# EAGLE design KatanaLRS-Rev1g (EAGLE 6.1)
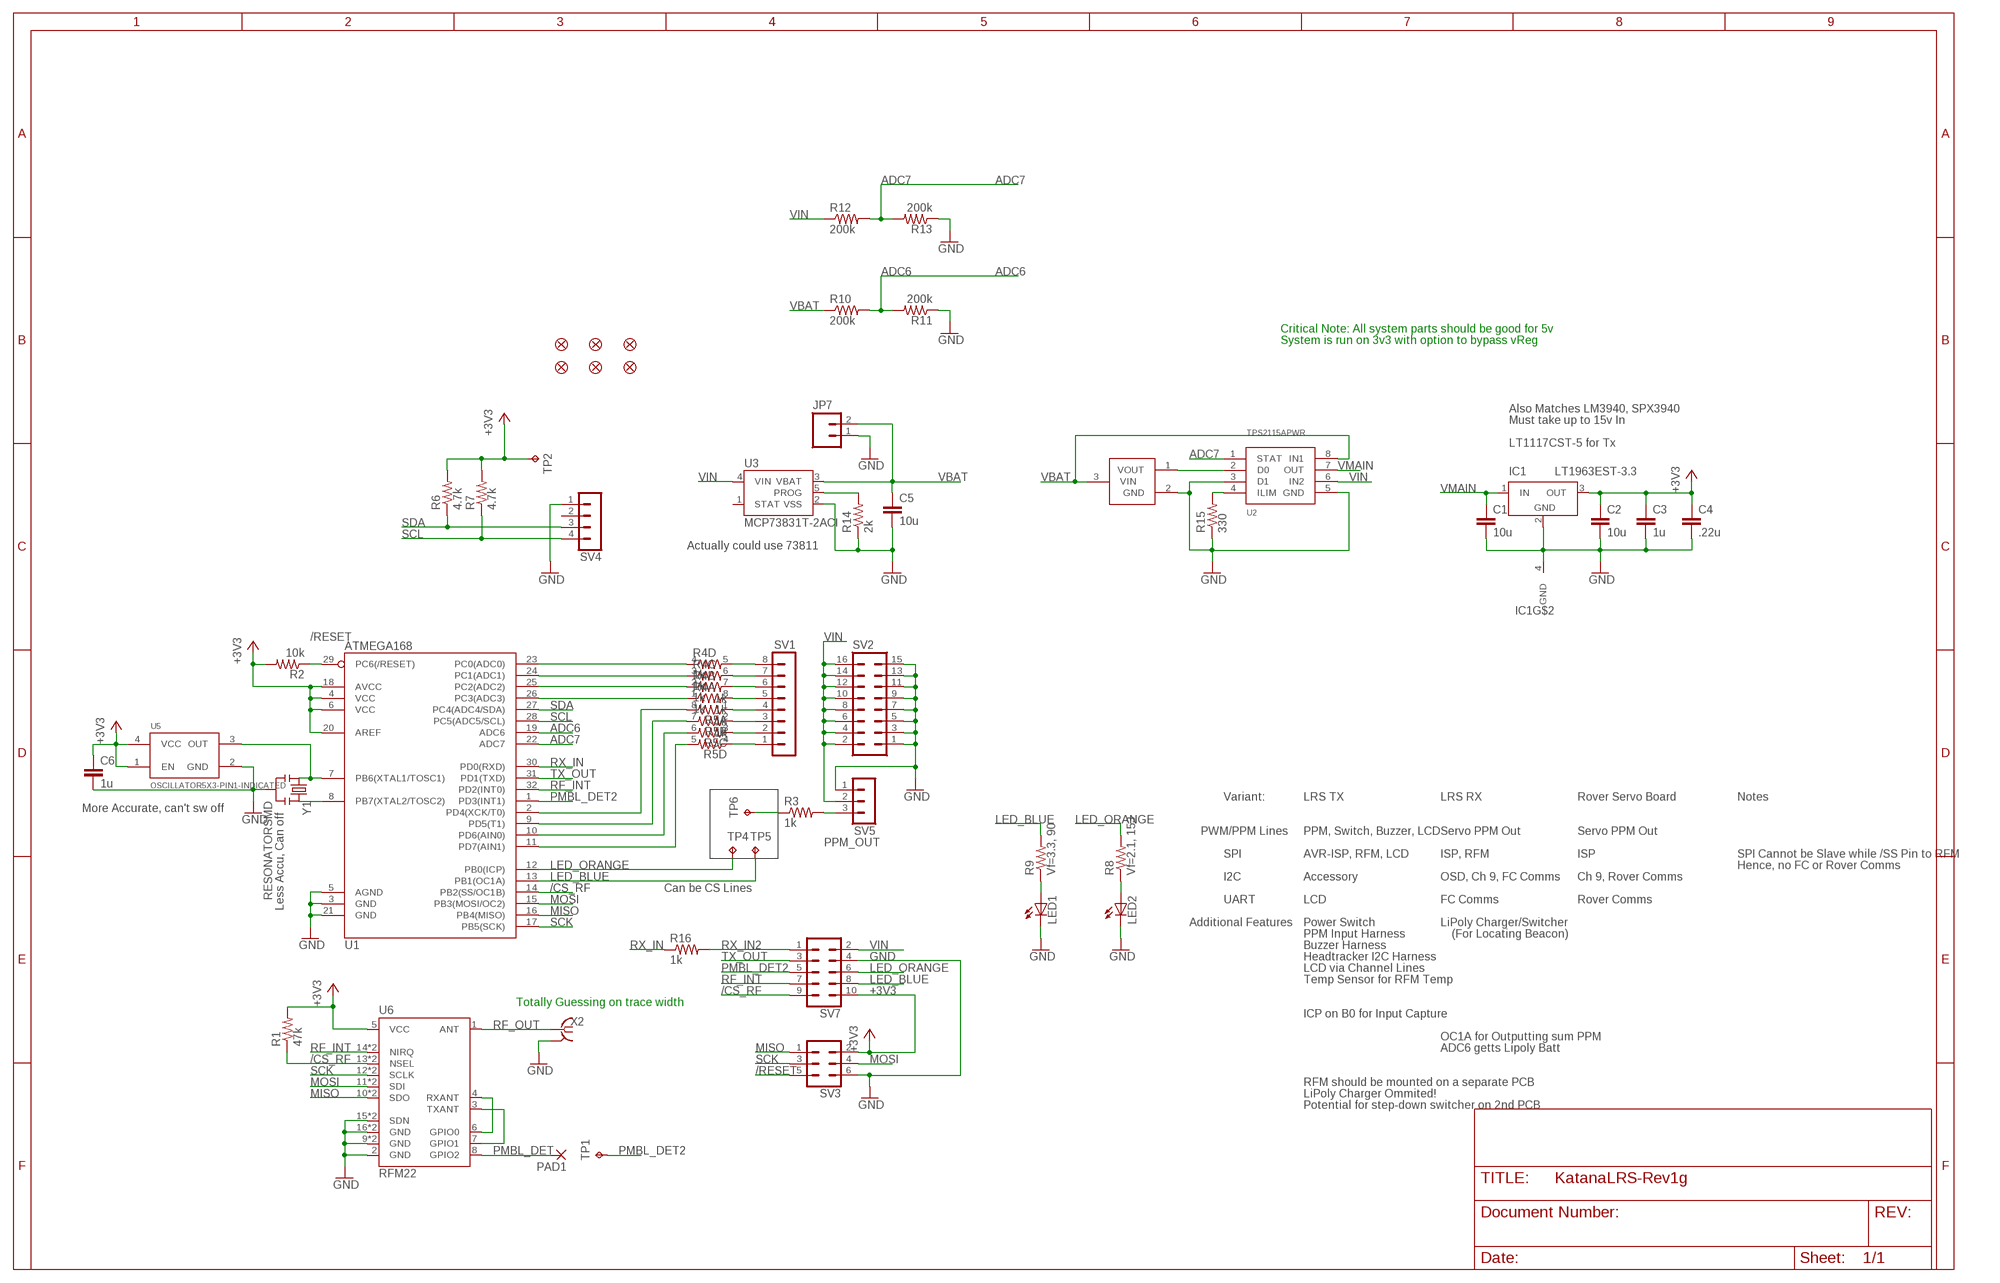
[diagram p0: schematic, sheet 1]

## Parts
C1  10u  CAP1206  [1206]
C2  10u  CAP1206  [1206]
C3  1u  CAP0603-CAP  [0603-CAP]
C4  .22u  CAP0603-CAP  [0603-CAP]
C5  10u  CAP1206  [1206]
C6  1u  CAP0805  [0805]
IC1  LT1963EST-3.3  [SOT223]
JP1  FIDUCIALUFIDUCIAL  [MICRO-FIDUCIAL]
JP2  FIDUCIALUFIDUCIAL  [MICRO-FIDUCIAL]
JP3  FIDUCIALUFIDUCIAL  [MICRO-FIDUCIAL]
JP4  FIDUCIALUFIDUCIAL  [MICRO-FIDUCIAL]
JP6  FIDUCIALUFIDUCIAL  [MICRO-FIDUCIAL]
JP7  M02JST-PTH-2  [JST-2-PTH]
JP11  FIDUCIALUFIDUCIAL  [MICRO-FIDUCIAL]
LED1  LED1206  [LED-1206]
LED2  LED1206  [LED-1206]
PAD1  SMD2  [SMD1,27-2,54]
R1  47k  R-US_R0603  [R0603]
R2  10k  R-US_R0603  [R0603]
R3  1k  R-US_R0603  [R0603]
R4  1k  RESISTOR-ARRAY0603-ARV  [0603-ARV]
R5  1k  RESISTOR-ARRAY0603-ARV  [0603-ARV]
R6  4.7k  R-US_R0603  [R0603]
R7  4.7k  R-US_R0603  [R0603]
R8  Vf=2.1, 153  R-US_R0805  [R0805]
R9  Vf=3.3, 90  R-US_R0805  [R0805]
R10  200k  R-US_R0603  [R0603]
R11  200k  R-US_R0603  [R0603]
R12  200k  R-US_R0603  [R0603]
R13  200k  R-US_R0603  [R0603]
R14  2k  R-US_R0603  [R0603]
R15  330  R-US_R0603  [R0603]
R16  1k  R-US_R0603  [R0603]
SV1  MA08-1  [MA08-1]
SV2  MA08-2  [MA08-2]
SV3  MA03-2  [MA03-2]
SV4  MA04-1  [MA04-1]
SV5  MA03-1  [MA03-1]
SV7  MA05-2  [MA05-2]
TP1  TPTP15SQ  [TP15SQ]
TP2  TPTP15SQ  [TP15SQ]
TP4  TPTP07SQ  [TP07SQ]
TP5  TPTP07SQ  [TP07SQ]
TP6  TPTP10SQ  [TP10SQ]
U1  ATMEGA168  [TQFP32-08]
U2  TPS2115APWR  TPS2115  [TSSOP8]
U3  MCP73831T-2ACI  MCP73831  [SOT23-5]
U4  TC54VC3002ECB713  TC54  [SOT23-3]
U5  OSCILLATOR5X3-PIN1-INDICATED  [CRYSTAL-OSC-SMD-5X3]
U6  RFM22  [RFM23B]
X2  Molex 073391-0060  BU-SMA-H  [BU-SMA-H]
Y1  RESONATORSMD  [RESONATOR-SMD]

## Nets
+3V3: C2.1 C3.1 C4.1 C6.1 IC1.3(OUT) R1.2 R2.2 R6.2 R7.2 SV3.2 SV7.10 TP2.TP U1.4(VCC) U1.6(VCC) U1.18(AVCC) U1.20(AREF) U5.1(EN) U5.4(VCC) U6.5(VCC)
/CS_RF: R1.1 SV7.9 U1.14(PB2(SS/OC1B)) U6.13(NSEL) U6.13B(NSEL)
/RESET: R2.1 SV3.5 U1.29(PC6(/RESET))
ADC6 [analog]: R10.2 R11.2 U1.19(ADC6)
ADC7 [analog]: R12.2 R13.2 U1.22(ADC7) U2.1(STAT)
GND: C1.2 C2.2 C3.2 C4.2 C5.2 C6.2 IC1.2(GND) IC1.4(GND) JP7.1 LED1.C LED2.C R11.1 R13.1 R14.1 R15.1 SV2.1 SV2.3 SV2.5 SV2.7 SV2.9 SV2.11 SV2.13 SV2.15 SV3.6 SV4.1 SV5.1 SV7.4 U1.3(GND) U1.5(AGND) U1.21(GND) U2.3(D1) U2.5(GND) U3.2(VSS) U4.2(GND) U5.2(GND) U6.2(GND) U6.9(GND) U6.9B(GND) U6.15(SDN) U6.15B(SDN) U6.16(GND) U6.16B(GND) X2.2(GND) Y1.2
LED_BLUE: R9.2 SV7.8 TP5.TP U1.13(PB1(OC1A))
LED_ORANGE: R8.2 SV7.6 TP4.TP U1.12(PB0(ICP))
MISO: SV3.1 U1.16(PB4(MISO)) U6.10(SDO) U6.10B(SDO)
MOSI: SV3.4 U1.15(PB3(MOSI/OC2)) U6.11(SDI) U6.11B(SDI)
N$3: U1.8(PB7(XTAL2/TOSC2)) Y1.3
N$4: U1.7(PB6(XTAL1/TOSC1)) U5.3(OUT) Y1.1
N$6 [analog]: R15.2 U2.4(ILIM)
N$9: U6.4(RXANT) U6.6(GPIO0)
N$10: LED1.A R9.1
N$11: R4.8 SV1.5
N$12: R4.7 SV1.6
N$13: R4.6 SV1.7
N$14: R4.5 SV1.8
N$15: U6.3(TXANT) U6.7(GPIO1)
N$16: R5.4 SV1.1
N$18: R5.3 SV1.2
N$23 [analog]: U2.2(D0) U4.1(VOUT)
N$24: LED2.A R8.1
N$25: R3.1 TP6.TP
N$26: R5.2 SV1.3
N$27: R5.1 SV1.4
N$28 [analog]: R14.2 U3.5(PROG)
P1: R4.4 U1.23(PC0(ADC0))
P2: R4.3 U1.24(PC1(ADC1))
P3: R4.2 U1.25(PC2(ADC2))
P4: R4.1 U1.26(PC3(ADC3))
P5: R5.8 U1.2(PD4(XCK/T0))
P6: R5.7 U1.9(PD5(T1))
P7: R5.6 U1.10(PD6(AIN0))
P8: R5.5 U1.11(PD7(AIN1))
PMBL_DET: PAD1.1(P) U6.8(GPIO2)
PMBL_DET2: SV7.5 TP1.TP U1.1(PD3(INT1))
PPM_OUT: R3.2 SV5.3
RF_INT: SV7.7 U1.32(PD2(INT0)) U6.14(NIRQ) U6.14B(NIRQ)
RF_OUT: U6.1(ANT) X2.1
RX_IN: R16.1 U1.30(PD0(RXD))
RX_IN2: R16.2 SV7.1
SCK: SV3.3 U1.17(PB5(SCK)) U6.12(SCLK) U6.12B(SCLK)
SCL: R7.1 SV4.4 U1.28(PC5(ADC5/SCL))
SDA: R6.1 SV4.3 U1.27(PC4(ADC4/SDA))
TX_OUT: SV7.3 U1.31(PD1(TXD))
VBAT: C5.1 JP7.2 R10.1 U2.8(IN1) U3.3(VBAT) U4.3(VIN)
VIN: R12.1 SV2.2 SV2.4 SV2.6 SV2.8 SV2.10 SV2.12 SV2.14 SV2.16 SV5.2 SV7.2 U2.6(IN2) U3.4(VIN)
VMAIN: C1.1 IC1.1(IN) U2.7(OUT)
Unconnected: SV4.2 U3.1(STAT)

## Notes on the sheet
- Critical Note: All system parts should be good for 5v
- System is run on 3v3 with option to bypass vReg
- Also Matches LM3940, SPX3940
- Must take up to 15v In
- LT1117CST-5 for Tx
- Actually could use 73811
- Variant: | LRS TX | LRS RX | Rover Servo Board | Notes
- More Accurate, can't sw off | Less Accu, Can off
- PWM/PPM Lines | PPM, Switch, Buzzer, LCD | Servo PPM Out | Servo PPM Out
- SPI | AVR-ISP, RFM, LCD | ISP, RFM | ISP | SPI Cannot be Slave while /SS Pin to RFM
- Hence, no FC or Rover Comms
- I2C | Accessory | OSD, Ch 9, FC Comms | Ch 9, Rover Comms
- Can be CS Lines
- UART | LCD | FC Comms | Rover Comms
- Additional Features | Power Switch | LiPoly Charger/Switcher
- PPM Input Harness | (For Locating Beacon)
- Buzzer Harness
- Headtracker I2C Harness
- LCD via Channel Lines
- Temp Sensor for RFM Temp
- Totally Guessing on trace width
- ICP on B0 for Input Capture
- OC1A for Outputting sum PPM
- ADC6 getts Lipoly Batt
- RFM should be mounted on a separate PCB
- LiPoly Charger Ommited!
- Potential for step-down switcher on 2nd PCB

## Power pins joined to a net without a drawn wire
GND: X2.3(GND) X2.4(GND) X2.5(GND)

## Library data of the parts
C1-C6 = SparkFun:CAP: Capacitor Standard 0603 ceramic capacitor, and 0.1" leaded capacitor.
IC1 = linear-technology:LT1963EST: 1.5A, Low Noise, Fast Transient Response LDO Regulator Source: http://www.linear.com/pc/downloadDocument.do?navId=H0,C3,P2222,D3148; MPN: LT1963EST-3.3; OC_FARNELL: 1501032; OC_NEWARK: 57M7546
JP1-JP4 JP6 JP11 = SparkFun:FIDUCIAL: Fiducial Alignment Points Various fiducial points for machine vision alignment.
JP7 = SparkFun:M02: Header 2 Standard 2-pin 0.1" header. Use with straight break away headers (SKU : PRT-00116), right angle break away headers (PRT-00553), swiss pins (PRT-00743), machine pins (PRT-00117), and female headers (PRT-00115). Molex polarized connector foot print use with SKU : PRT-08233 with associated crimp pins and housings.
LED1 LED2 = SparkFun:LED: LEDs Standard schematic elements and footprints for 5mm, 3mm, 1206, and 0603 sized LEDs. 5mm - Spark Fun Electronics SKU : COM-00529 (and others)
PAD1 = wirepad:SMD2: SMD PAD
R1-R3 R6-R16 = resistor:R-US_: RESISTOR, American symbol
R4 R5 = SparkFun:RESISTOR-ARRAY: Array Chip Resistor Source: RS Component / Phycomp
SV1 = con-lstb:MA08-1: PIN HEADER; OC_FARNELL: unknown; OC_NEWARK: unknown
SV2 = con-lstb:MA08-2: PIN HEADER; OC_FARNELL: unknown; OC_NEWARK: unknown
SV3 = con-lstb:MA03-2: PIN HEADER; OC_FARNELL: unknown; OC_NEWARK: unknown
SV4 = con-lstb:MA04-1: PIN HEADER; OC_FARNELL: unknown; OC_NEWARK: unknown
SV5 = con-lstb:MA03-1: PIN HEADER; OC_FARNELL: unknown; OC_NEWARK: unknown
SV7 = con-lstb:MA05-2: PIN HEADER; OC_FARNELL: unknown; OC_NEWARK: unknown
TP1 TP2 TP4-TP6 = testpad:TP: Test pad
U1 = SparkFun:ATMEGA168
U2 = SteveCustom:TPS2115
U3 = SparkFun:MCP73831: Microchip's MCP73831 Miniature single cell, fully integrated Li-Ion, Li-polymer charge management controller http://ww1.microchip.com/downloads/en/DeviceDoc/21984a.pdf
U4 = SparkFun:TC54
U5 = SparkFun:OSCILLATOR
U6 = SparkFun:RFM22: Description: The RFM22 is a low-power, low cost radio that is capable of operating in the 434MHz and 900MHz open bands. It's frequency is software defined and there are some very good libraries written for it.
X2 = con-coax:BU-SMA-H: FEMALE SMA CONNECTOR Radiall; OC_FARNELL: unknown; OC_NEWARK: unknown
Y1 = SparkFun:RESONATOR: Resonator Small SMD resonator. This is the itty bitty 10/20MHz resonators with built in caps. CSTCE10M0G55 and CSTCE20M0V53. Footprint has been reviewed closely but hasn't been tested yet.

## Net classes
1 digital: width 0.406 mm
2 analog: width 0.254 mm
3 power: width 0.61 mm

## Board
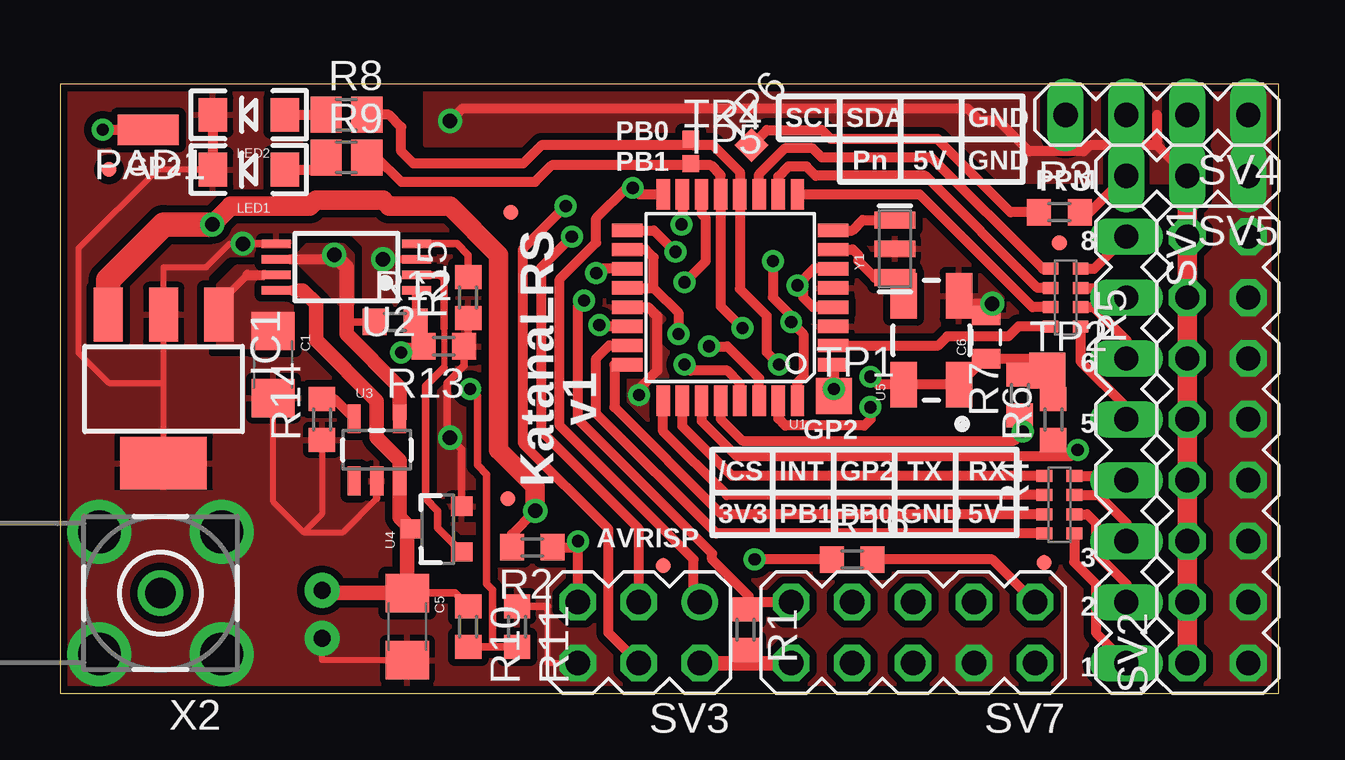
[diagram p1: board, top side]
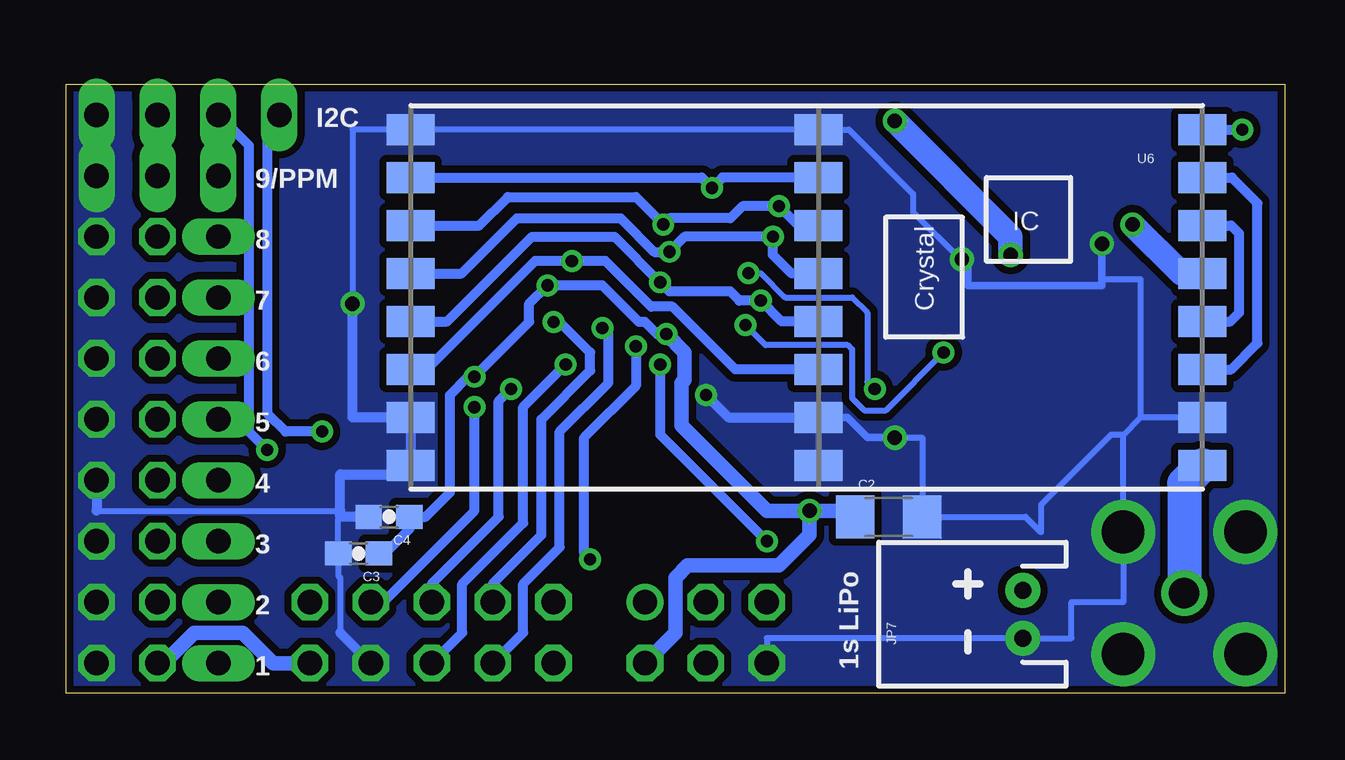
[diagram p2: board, bottom side, seen from below]

Size 50.8 x 25.4 mm. Coordinates in mm from the lower left corner, seen from the top.
Outline: 0,0 50.8,0 50.8,25.4 0,25.4 0,0
Copper layers (1*16): Top 0.035mm / dielectric 1.5mm / Bottom 0.035mm
Design rules: minimum track width 8mil, minimum drill 18mil, track to track 8mil, track to pad 8mil, pad to pad 8mil, via to via 8mil, smd to smd 0mil, copper to edge 1mil, drill to drill 8mil, minimum pad ring 10mil, minimum via ring 8mil, stop-mask expansion 4mil, vias tented up to drill 0mil, thermal gap 10mil
tRestrict: area 46.2,23.4 to 47.8,24.9

### Footprints (pad centres in the part's own frame; a part is rotated, then mirrored left to right if it is on the bottom)
1206 = smd 1.6 x 1.8: 1 -1.4,0; 2 1.4,0
0603-CAP = smd 1.1 x 1: 1 -0.85,0; 2 0.85,0
0805 = smd 0.8 x 1.2: 1 -0.9,0; 2 0.9,0
SOT223 = smd 1.219 x 2.235: 1 -2.311,-3.099; 2 0,-3.099; 3 2.311,-3.099 | smd 3.6 x 2.2: 4 0,3.099
MICRO-FIDUCIAL = smd 0.635 x 0.635: 1 0,0
JST-2-PTH = drill 0.7 pad 1.448: 1 -1,0; 2 1,0
LED-1206 = smd 1.2 x 1.4: A -1.5,0; C 1.5,0
SMD1,27-2,54 = smd 1.27 x 2.54: 1 0,0
R0603 = smd 1 x 1.1: 1 -0.85,0; 2 0.85,0
0603-ARV = smd 0.5 x 0.65: 1 -1.2,-0.625; 2 -0.4,-0.625; 3 0.4,-0.625; 4 1.2,-0.625; 5 1.2,0.625; 6 0.4,0.625; 7 -0.4,0.625; 8 -1.2,0.625
R0805 = smd 1.3 x 1.5: 1 -0.85,0; 2 0.85,0
MA08-1 = drill 1.016 long: 1 -8.89,0; 2 -6.35,0; 3 -3.81,0; 4 -1.27,0; 5 1.27,0; 6 3.81,0; 7 6.35,0; 8 8.89,0
MA08-2 = drill 1.016 octagon: 1 -8.89,-1.27; 2 -8.89,1.27; 3 -6.35,-1.27; 4 -6.35,1.27; 5 -3.81,-1.27; 6 -3.81,1.27; 7 -1.27,-1.27; 8 -1.27,1.27; 9 1.27,-1.27; 10 1.27,1.27; 11 3.81,-1.27; 12 3.81,1.27; 13 6.35,-1.27; 14 6.35,1.27; 15 8.89,-1.27; 16 8.89,1.27
MA03-2 = drill 1.016: 1 -2.54,-1.27 | drill 1.016 octagon: 2 -2.54,1.27; 3 0,-1.27; 4 0,1.27; 5 2.54,-1.27; 6 2.54,1.27
MA04-1 = drill 1.016 long: 1 -3.81,0; 2 -1.27,0; 3 1.27,0; 4 3.81,0
MA03-1 = drill 1.016 long: 1 -2.54,0; 2 0,0; 3 2.54,0
MA05-2 = drill 1.016 octagon: 1 -5.08,-1.27; 2 -5.08,1.27; 3 -2.54,-1.27; 4 -2.54,1.27; 5 0,-1.27; 6 0,1.27; 7 2.54,-1.27; 8 2.54,1.27; 9 5.08,-1.27; 10 5.08,1.27
TP15SQ = smd 1.5 x 1.5: TP 0,0
TP07SQ = smd 0.7 x 0.7: TP 0,0
TP10SQ = smd 1 x 1: TP 0,0
TQFP32-08 = smd 1.27 x 0.559: 1 -4.293,2.8; 2 -4.293,2; 3 -4.293,1.2; 4 -4.293,0.4; 5 -4.293,-0.4; 6 -4.293,-1.2; 7 -4.293,-2; 8 -4.293,-2.8; 17 4.293,-2.8; 18 4.293,-2; 19 4.293,-1.2; 20 4.293,-0.4; 21 4.293,0.4; 22 4.293,1.2; 23 4.293,2; 24 4.293,2.8 | smd 0.559 x 1.27: 9 -2.8,-4.293; 10 -2,-4.293; 11 -1.2,-4.293; 12 -0.4,-4.293; 13 0.4,-4.293; 14 1.2,-4.293; 15 2,-4.293; 16 2.8,-4.293; 25 2.8,4.293; 26 2,4.293; 27 1.2,4.293; 28 0.4,4.293; 29 -0.4,4.293; 30 -1.2,4.293; 31 -2,4.293; 32 -2.8,4.293
TSSOP8 = smd 1.2 x 0.35: 1 -2.925,0.975; 2 -2.925,0.325; 3 -2.925,-0.325; 4 -2.925,-0.975; 5 2.925,-0.975; 6 2.925,-0.325; 7 2.925,0.325; 8 2.925,0.975
SOT23-5 = smd 0.55 x 1.2: 1 -0.95,-1.3; 2 0,-1.3; 3 0.95,-1.3; 4 0.95,1.3; 5 -0.95,1.3
SOT23-3 = smd 0.8 x 0.9: 1 -0.95,-1; 2 0.95,-1; 3 0,1.1
CRYSTAL-OSC-SMD-5X3 = smd 1.9 x 1.1: 1 -1.85,-1.15; 2 1.85,-1.15; 3 1.85,1.15; 4 -1.85,1.15
RFM23B = smd 2 x 1.3: 1 -8,7; 2 -8,5; 3 -8,3; 4 -8,1; 5 -8,-1; 6 -8,-3; 7 -8,-5; 8 -8,-7; 9 8,-7; 9B 25,-7; 10 8,-5; 10B 25,-5; 11 8,-3; 11B 25,-3; 12 8,-1; 12B 25,-1; 13 8,1; 13B 25,1; 14 8,3; 14B 25,3; 15 8,5; 15B 25,5; 16 8,7; 16B 25,7
BU-SMA-H = drill 1.27: 1 0,0 | drill 1.778: 2 -2.55,2.55; 3 2.55,2.55; 4 2.55,-2.55; 5 -2.55,-2.55
RESONATOR-SMD = smd 0.7 x 1.7: 1 -1.2,0; 2 0,0; 3 1.2,0

### Placement (x,y rotation side)
C1  8.89,13.72 270 top
C2  16.51,7.37 0 bottom
C3  38.61,5.84 180 bottom
C4  37.34,7.37 180 bottom
C5  14.48,2.79 270 top
C6  38.61,14.86 90 top
IC1  4.32,12.7 180 top
JP1  41.66,18.8 0 top
JP2  41.02,5.46 0 top
JP3  25.15,5.33 0 top
JP4  18.8,20.07 0 top
JP6  18.67,8.13 0 top
JP7  10.92,3.3 90 bottom
JP11  2.03,21.84 0 top
LED1  7.87,21.84 180 top
LED2  7.87,24.13 180 top
PAD1  3.68,23.5 90 top
R1  28.57,2.67 270 top
R2  19.68,6.1 180 top
R3  41.66,20.07 0 top
R4  41.66,7.87 270 top
R5  41.91,16.51 90 top
R6  41.4,11.43 90 top
R7  40.01,12.45 90 top
R8  11.94,24.13 0 top
R9  11.94,22.35 0 top
R10  17.02,2.79 270 top
R11  19.05,2.79 270 top
R12  13.97,15.49 0 top
R13  16,14.48 180 top
R14  10.92,11.43 90 top
R15  17.02,16.51 90 top
R16  33.02,5.59 0 top
SV1  44.45,10.16 270 top
SV2  48.26,10.16 90 top
SV3  24.13,2.54 180 top
SV4  45.72,24.13 180 top
SV5  46.99,21.59 180 top
SV7  35.56,2.54 180 top
TP1  32.26,12.4 0 top
TP2  41.15,13.46 0 top
TP4  26.29,23.11 0 top
TP5  26.29,22.1 0 top
TP6  28.83,22.86 45 top
U1  27.94,16.51 180 top
U2  11.94,17.78 180 top
U3  13.21,10.16 0 top
U4  15.75,6.86 90 top
U5  36.32,14.73 90 top
U6  11.43,16.51 180 bottom
X2  4.19,4.19 180 top
Y1  34.8,18.54 90 top

### Tracks (layer width: path | path; a pad name or v marks a point on that pad's centre or on a via)
+3V3  (via drill 0.51, 0.6)
  Top 0.406: v33.78,13.21 34.11,12.88 U5.4 U5.1 38.55,13.96 C6.1 41.15,13.96 TP2.TP | U1.20 24.75,16.91 | 24.75,16.91 25.78,15.88 v25.78,14.99 | U1.6 31.43,17.71 v30.73,17.02 30.99,16.76 30.99,16.51 31.39,16.11 U1.4 | U1.18 24.42,18.51 24.75,18.18 24.75,16.91 | R1.2 28.7,1.69 28.7,1.27 | R2.2 18.84,6.64 v19.81,7.62 | R6.2 41.15,12.28 TP2.TP | R7.2 41.15,13.3 TP2.TP
  Top 0.61: SV7.10 28.7,1.27 SV3.2
  Top 0.813: v19.81,7.62 19.81,8.64 18.29,10.16 18.29,18.29 16.26,20.32 13.72,20.32 13.46,20.57 10.67,20.57 10.41,20.32 7.11,20.32 v6.35,19.56
  Top 1.016: IC1.3 2.01,17.25 4.32,19.56 v6.35,19.56
  Bottom 0.406: v25.78,14.99 26.16,14.99 26.67,15.49 26.92,15.49 28.45,17.02 v30.73,17.02 31.5,16.26 31.5,15.49 v33.78,13.21 34.04,13.21 34.8,12.45 34.8,8.38 35.81,7.37 C4.1 36.49,6.86 37.5,5.84 C3.1
  Bottom 0.61: v25.78,14.99 25.02,14.22 25.02,13.08 25.15,12.95 25.15,11.18 21.59,7.62 v19.81,7.62 | SV3.2 25.4,2.54 25.4,4.83 24.89,5.33 21.08,5.33 19.81,6.6 v19.81,7.62 | C2.1 18.16,7.62 v19.81,7.62
  Bottom 0.813: U6.5 3.43,17.53
  Bottom 1.016: v6.35,19.56 4.3,17.51 U6.5
/CS_RF  (via drill 0.51)
  Top 0.406: SV7.9 28.7,3.81 | 28.7,3.81 28.7,4.06 27.18,5.59 27.18,5.84 21.59,11.43 21.59,16.13 v21.84,16.38 | U1.14 26.74,20 26.92,19.81 26.92,18.03 v26.04,17.14 | R1.1 28.7,3.64 28.7,3.81
  Bottom 0.406: U6.13B 34.91,15.51 31.37,19.05 27.94,19.05 v26.04,17.14 25.65,16.76 23.11,16.76 22.73,16.38 v21.84,16.38 20.97,15.51 U6.13
/RESET  (via drill 0.51)
  Top 0.406: U1.29 28.34,12.94 27.81,13.46 26.29,13.46 v26.04,13.72 | SV3.5 v21.59,6.35 21.34,6.1 R2.1
  Bottom 0.406: v21.59,6.35 26.04,10.79 v26.04,13.72
ADC6  (via drill 0.51)
  Top 0.305: R11.2 18.03,1.94 | 18.03,1.94 R10.2 | v17.09,12.7 17.4,12.39 17.4,9.53 17.78,9.14 17.78,4.57 18.03,4.32 18.03,1.94
  Top 0.406: U1.19 22.54,17.71 v22.35,17.53
  Bottom 0.254: v22.35,17.53 21.84,17.53 20.83,16.51 18.03,16.51 17.4,15.88 17.4,13.01 v17.09,12.7
ADC7  (via drill 0.51)
  Top 0.254: U2.1 14.82,16.8
  Top 0.305: 14.82,16.8 R12.2 14.82,14.81 R13.2 14.48,14.48 v14.22,14.22
  Top 0.406: U1.22 22.54,15.31 v22.48,15.37
  Bottom 0.254: v22.48,15.37 21.64,14.53 18.21,14.53 18.03,14.35 18.03,12.32 17.53,11.81 16.64,11.81 v14.22,14.22
GND  (via drill 0.51, 0.6)
  Top 0.254: SV3.6 20.32,1.27 20.32,3.64 | C5.2 10.92,1.39 JP7.1 | IC1.4 4.32,12.95 | 4.32,12.95 IC1.2 4.32,17.78 6.1,17.78 7.07,18.75 v7.62,18.75 | LED1.C 4.06,21.84 0.76,18.54 0.76,14.22 2.03,12.95 4.32,12.95 | 13.21,8.13 11.8,6.72 10.16,6.72 | R14.1 10.92,7.48 10.16,6.72 | 10.16,6.72 8.89,7.99 C1.2 | 16.13,10.79 v16.26,10.67
  Top 0.305: R11.1 20.32,3.64 | U2.3 v13.46,18.11 | U2.5 v7.62,18.75 | 13.21,8.13 U3.2 | C1.2 8.89,12.61 | U4.2 16.75,10.18 v16.26,10.67 | R15.1 17.02,14.64 R13.1 16.85,13.68 16.13,12.95 16.13,10.79
  Top 0.406: U5.2 37.8,16.26 v38.86,16.26 38.61,16 C6.2 | U1.21 24.53,16.11 24.89,15.75 24.89,13.46 24.13,12.7 v24.13,12.45 | LED2.C LED1.C
  Bottom 0.254: 49.53,7.62 39.37,7.62 | U6.15 U6.16 | U6.2 6.02,11.51 | 6.74,10.79 X2.5 6.74,3.81 8.89,3.81 8.89,2.3 JP7.1 21.59,2.3 SV3.6 | 6.74,10.79 6.02,11.51 | 7.62,17.27 6.02,17.27 6.02,11.51 | v16.26,10.67 15.11,10.67 C2.2 10.8,7.37 10.16,6.72 10.16,7.87 7.25,10.79 6.74,10.79 | 39.37,7.37 39.46,7.28 C3.2 39.46,4.91 39.37,4.83 39.37,2.54 | v38.86,16.26 38.86,23.51 U6.9B U6.9 18.18,23.51 15.49,20.83 15.49,20.07 13.53,18.11 v13.46,18.11
  Bottom 0.305: U6.15 18.24,11.51 17.4,10.67 v16.26,10.67 | v13.46,18.11 13.21,18.11 13.21,17.02 7.62,17.02 7.62,17.27 v7.62,18.75
  Bottom 0.406: v38.86,16.26 38.86,11.51 U6.15B U6.16B 36.43,9.14 39.37,9.14 39.37,7.62 39.37,7.37 C4.2 | v24.13,12.45 23.19,11.51 U6.15 | SV2.7 49.53,7.62 | SV7.4 39.37,2.54
  pour Bottom (isolate 0.305, rank 3, no thermals): 0,25.4 50.8,25.4 50.8,0 0,0
  pour Top (isolate 0.305, rank 6): 0,25.4 50.8,25.4 50.8,0 0,0
  pour Top (isolate 0.305, no thermals): 50.8,25.4 50.8,0 48.51,0 48.51,25.4
  pour Top (isolate 0.305, no thermals): 20.32,2.29 22.61,2.29 22.61,0 20.32,0
  pour Top (isolate 0.305, no thermals): 37.08,0 37.08,2.29 39.12,2.29 39.12,0
  pour Top (isolate 0.305, no thermals): 0,8.38 8.38,8.38 8.38,0 0,0
  pour Top (isolate 0.305, no thermals): 9.65,3.56 12.19,3.56 12.19,1.02 9.65,1.02
LED_BLUE  (via drill 0.51)
  Top 0.406: v28.45,15.24 27.54,16.15 U1.13 27.54,21.61 27.13,22.02 26.36,22.02 | 26.36,22.02 20.5,22.02 19.81,21.34 14.22,21.34 13.21,22.35 R9.2 | TP5.TP 26.36,22.02
  Bottom 0.406: SV7.8 31.75,2.54 31.75,4.57 30.23,6.1 30.23,10.92 28.19,12.95 28.19,14.99 v28.45,15.24
LED_ORANGE  (via drill 0.51)
  Top 0.406: v29.97,13.72 29.46,14.22 29.46,15.75 28.34,16.87 U1.12 28.34,21.75 27.23,22.86 26.42,22.86 | 26.42,22.86 20.07,22.86 19.3,22.1 14.73,22.1 14.22,22.61 14.22,23.62 13.72,24.13 R8.2 | TP4.TP 26.42,22.99 26.42,22.86
  Bottom 0.406: SV7.6 34.29,2.54 34.29,4.57 31.75,7.11 31.75,11.94 v29.97,13.72
MISO  (via drill 0.51)
  Top 0.406: SV3.1 26.42,4.06 26.42,5.59 20.83,11.18 20.83,17.27 22.35,18.8 22.35,19.81 23.62,21.08 v23.88,21.08 24.16,20.8 U1.16
  Bottom 0.406: U6.10 23.45,21.51 v23.88,21.08 24.3,21.51 U6.10B
MOSI  (via drill 0.51)
  Top 0.406: SV3.4 22.86,2.54 22.86,6.86 19.3,10.41 19.3,18.54 v21.08,20.32 | U1.15 25.94,19.59 v25.91,19.56
  Bottom 0.406: U6.11 20.27,19.51 v21.08,20.32 22.61,20.32 23.11,19.81 25.65,19.81 v25.91,19.56 27.05,20.7 32.38,20.7 33.58,19.51 U6.11B
N$3
  Top 0.406: U1.8 33.03,19.31 33.46,19.74 Y1.3
N$4
  Top 0.406: U1.7 33.05,18.51 33.27,18.29 33.27,18.03 33.97,17.34 Y1.1 35.17,16.97 U5.3
N$6
  Top 0.305: R15.2 17.02,18.29 16.55,18.75 U2.4
N$9
  Bottom 0.406: U6.4 2.27,15.51 1.91,15.88 1.91,19.18 2.24,19.51 U6.6
N$10
  Top 0.406: LED1.A 10.58,21.84 R9.1
N$11
  Top 0.406: R4.8 44.27,9.07 SV1.5
N$12
  Top 0.406: R4.7 43.29,8.27 44.45,7.11 SV1.6
N$13
  Top 0.406: R4.6 42.82,7.47 43.18,7.11 43.18,5.84 44.45,4.57 SV1.7
N$14
  Top 0.406: R4.5 42.28,5.47 43.18,4.57 43.18,2.54 SV1.8
N$15
  Bottom 0.406: U6.3 2.24,13.51 1.14,14.61 1.14,20.45 2.21,21.51 U6.7
N$16
  Top 0.406: R5.4 43.11,17.71 SV1.1
N$18
  Top 0.406: R5.3 44.05,16.91 SV1.2
N$23
  Top 0.254: 16,15.24 16,13.59
  Top 0.305: U2.2 15.82,17.45 16,17.27 16,15.24 | U4.1 15.75,6.91 15.75,7.62 15.24,8.13 15.24,12.83 16,13.59
N$24
  Top 0.406: LED2.A R8.1
N$25
  Top 0.406: R3.1 39.62,20.07 36.58,23.11 32.13,23.11 31.75,23.5 29.46,23.5 TP6.TP
N$26
  Top 0.406: R5.2 43.07,16.11 44.45,14.73 SV1.3
N$27
  Top 0.406: R5.1 42.53,13.85 44.45,11.94 SV1.4
N$28
  Top 0.406: U3.5 11.44,12.28 R14.2
P1
  Top 0.406: R4.4 27.36,6.67 22.35,11.68 22.35,13.97 22.89,14.51 U1.23
P2
  Top 0.406: R4.3 27.58,7.47 23.11,11.94 23.11,13.71 U1.24
P3
  Top 0.406: R4.2 27.79,8.27 25.14,10.93 U1.25
P4
  Top 0.406: R4.1 28.01,9.07 25.94,11.14 U1.26
P5
  Top 0.406: R5.8 39.95,15.31 39.53,14.89 36.99,14.89 36.61,14.51 U1.2
P6
  Top 0.406: R5.7 40.53,16.11 35.84,20.8 U1.9
P7
  Top 0.406: R5.6 40.75,16.91 36.07,21.59 31.5,21.59 31.11,21.97 30.35,21.97 29.94,21.56 U1.10
P8
  Top 0.406: R5.5 40.96,17.71 36.32,22.35 31.75,22.35 31.37,22.73 30.23,22.73 29.14,21.65 U1.11
PMBL_DET  (via drill 0.51)
  Top 0.406: PAD1.1 1.78,23.5 v1.78,23.51
  Bottom 0.406: U6.8 v1.78,23.51
PMBL_DET2  (via drill 0.51)
  Top 0.406: TP1.TP v32.26,12.7 | v32.26,12.7 32.26,13.18 | U1.1 32.26,13.71 v32.26,12.7
  Bottom 0.406: SV7.5 35.56,4.57 32.77,7.37 32.77,12.19 v32.26,12.7
PPM_OUT
  Top 0.406: R3.2 42.93,20.07 SV5.3
RF_INT  (via drill 0.51)
  Top 0.406: v29.72,18.03 29.72,16.51 30.48,15.75 v30.48,15.49 30.99,14.99 30.99,13.21 30.74,12.96 U1.32
  Bottom 0.406: U6.14 22.91,13.51 25.53,16.13 26.42,16.13 28.32,18.03 v29.72,18.03 31.24,18.03 35.77,13.51 U6.14B | SV7.7 33.02,4.57 30.99,6.6 30.99,11.43 28.96,13.46 28.96,14.22 30.23,15.49 v30.48,15.49
RF_OUT
  Bottom 1.422: X2.1 4.19,8.75 U6.1
RX_IN  (via drill 0.51)
  Top 0.406: v27.05,14.48 27.81,14.48 29.14,13.15 U1.30 | R16.1 v28.96,5.59
  Bottom 0.406: v28.96,5.59 29.21,5.84 29.21,10.67 27.05,12.83 v27.05,14.48
RX_IN2
  Top 0.406: SV7.1 38.86,5.59 R16.2
SCK  (via drill 0.51)
  Top 0.406: SV3.3 24.13,6.86 20.07,10.92 20.07,17.78 v21.34,19.05 | U1.17 24.76,19.31 v25.65,18.41
  Bottom 0.406: U6.12 20.56,17.51 21.34,18.29 v21.34,19.05 25.02,19.05 v25.65,18.41 26.29,18.41 27.69,19.81 32,19.81 34.31,17.51 U6.12B
SCL  (via drill 0.51)
  Top 0.406: U1.28 27.54,11.45 28.45,10.54 39.75,10.54 v40.13,10.92 40.01,11.05 R7.1
  Bottom 0.406: SV4.4 42.42,23.62 42.42,11.68 41.66,10.92 v40.13,10.92
SDA  (via drill 0.51)
  Top 0.406: U1.27 26.74,11.36 28.19,9.91 41.4,9.91 | 41.4,9.91 42.16,9.91 v42.42,10.16 | R6.1 41.4,9.91
  Bottom 0.406: SV4.3 43.18,22.86 43.18,10.92 v42.42,10.16
TX_OUT  (via drill 0.51)
  Top 0.406: v33.78,11.94 33.78,11.43 33.53,11.18 30.23,11.18 29.94,11.46 U1.31
  Bottom 0.406: v33.78,11.94 33.78,7.62 37.59,3.81 SV7.3
VBAT
  Top 0.305: U2.8 9.65,16.8 | R10.1 16.47,4.19 C5.1
  Top 0.406: 9.65,16.8 9.91,16.8
  Top 0.61: 9.91,16.8 10.12,16.8 10.67,16.26 10.67,14.73 13.21,12.19 13.21,10.67 14.16,9.72 U3.3 14.16,7.35 14.48,7.03 14.48,6.86 | 14.48,6.86 C5.1 11.03,4.19 JP7.2 | U4.3 14.48,6.86
VIN  (via drill 0.6)
  Top 0.305: U2.6 9.6,18.11 | R12.1 11.94,15.49
  Top 0.406: 45.72,24.13 45.72,22.86 | 45.72,22.86 SV5.2 | 46.99,10.16 SV2.10 | 45.72,22.86 42.93,22.86 42.67,22.61 40.39,22.61 39.12,23.88 38.35,23.88 37.85,24.38 16.76,24.38 v16.26,23.88 | 9.6,18.11 11.25,18.11 v11.43,18.29
  Top 0.61: U3.4 14.16,12.77 11.94,14.99 11.94,15.49 11.94,17.78 v11.43,18.29
  Top 0.813: SV2.2 SV2.4 SV2.6 SV2.8 SV2.10 SV2.12 SV2.14 SV2.16 SV5.2
  Bottom 0.61: SV2.2 46.74,1.27 45.47,2.54 43.43,2.54 42.16,1.27 SV7.2
  Bottom 1.016: v16.26,23.88 11.43,19.05 v11.43,18.29
  pour Top (isolate 0.305, rank 2): 15.24,22.86 15.24,25.4 47.24,25.4 47.24,21.34 39.12,21.34 37.59,22.86
  pour Top (no thermals): 45.47,23.11 45.97,22.61 47.24,22.61 47.24,21.34 43.18,21.34 43.18,23.11
  pour Top (isolate 0.305, no thermals): 12.19,18.29 11.81,18.67 10.29,18.67 9.91,18.29 8.89,18.29 8.89,18.03 9.91,18.03 11.68,16.26 12.19,16.26
VMAIN
  Top 0.305: IC1.1 6.63,16.28 7.8,17.45 | 8.51,17.45 U2.7
  Top 0.406: 7.8,17.45 8.51,17.45
  pour Top (isolate 0.305, no thermals): 9.65,14.48 9.65,16.76 9.4,17.02 9.4,17.53 8.38,17.53 8.13,17.78 7.37,17.78 6.6,17.02 6.6,14.48

### Text on the board
tPlace: PB0 | SCL | SDA | GND | PB1 | GP2 | Pn | 5V | GND | PPM | 8 | 6 | 5 | v1 | GP2 | KatanaLRS | /CS | INT | GP2 | TX | RX | 3V3 | PB1 | PB0 | GND | 5V | AVRISP | 3 | 2 | 1
bPlace: I2C | 9/PPM | 8 | 7 | 6 | 5 | 4 | 3 | 2 | 1s LiPo | 1
tDocu: /R | SCK | SO | GND | SI | 3V3 | J1 | TPS2115 | LT1963 | MCP73831 | TC54VC